# EAGLE design PCB (EAGLE 9.6.2)
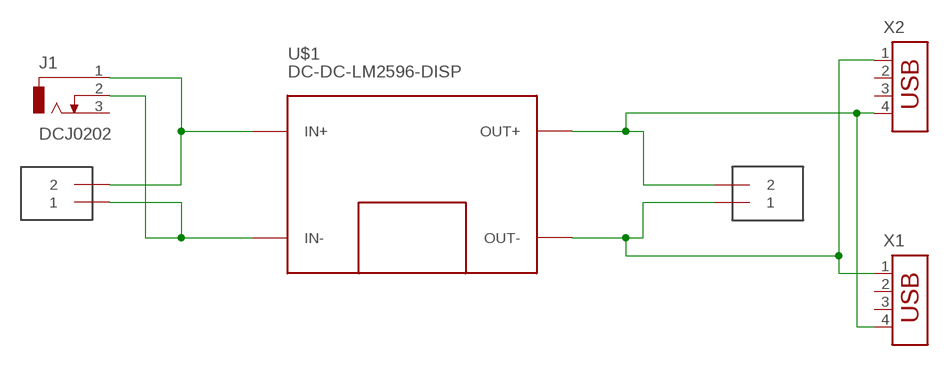
[diagram p0: schematic, sheet 1]

## Parts
J1  DCJ0202  [DCJ0202]
U$1  DC-DC-LM2596-DISP  [DC-DC-LM2596-DISP]
U$2  TERMINAL_2P  [KF301-2P]
U$3  TERMINAL_2P  [KF301-2P]
X1  USB-787616  [USB]
X2  USB-787616  [USB]

## Nets
N$1: J1.1 U$1.IN+ U$2.2
N$2: J1.2 U$1.IN- U$2.1
N$4: U$1.OUT+ U$3.2 X1.4 X2.4
N$6: U$1.OUT- U$3.1 X1.1 X2.1
Unconnected: J1.3 X1.2 X1.3 X2.2 X2.3

## Library data of the parts
J1 = con-jack:DCJ0202: DC POWER JACK Source: DCJ0202.pdf; OC_FARNELL: unknown; OC_NEWARK: unknown
U$1 = lm2596:DC-DC-LM2596-DISP: DC/DC Step-Down Regulator with Voltage Display based on LM2596-ADJ chip More details available here: http://www.instructables.com/id/The-Introduction-of-LM2596-Step-Down-Power-Module-/ LM2596 datasheet available here: http://www.ti.com/lit/ds/symlink/lm2596.pdf Click here to find device on ebay.com <http://www.ebay.com/sch/lm2596+led+voltmeter+40>
U$2 U$3 = KF301-2P-Terminal:TERMINAL_2P: Terminal Screw 2 Port 5mm Pitch
X1 X2 = con-amp:USB-787616: AMP connector

## Board
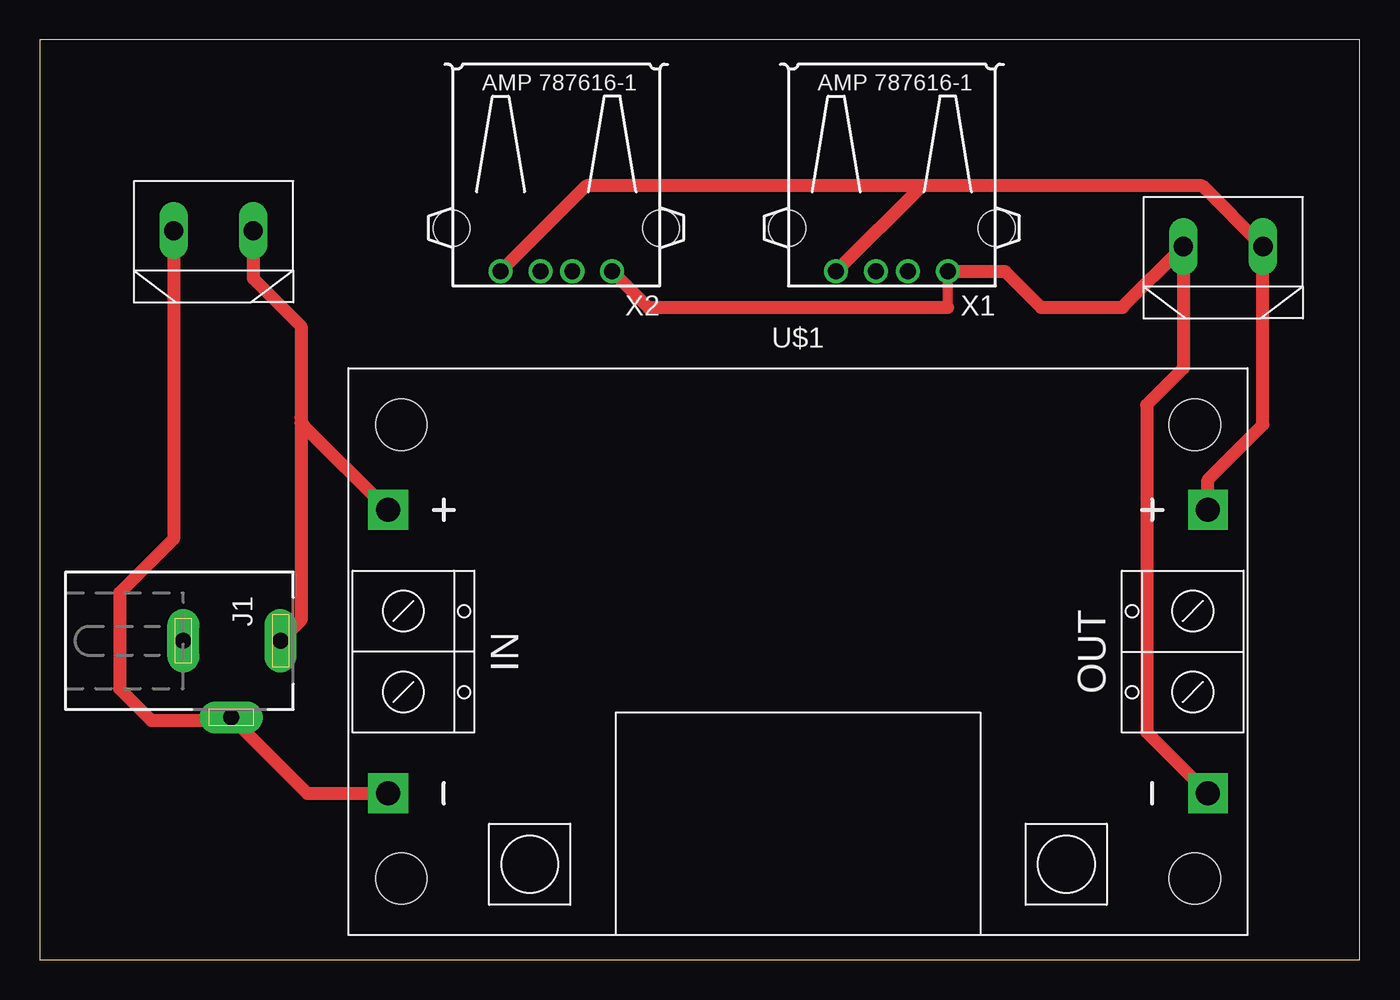
[diagram p1: board, top side]

Size 82.79 x 57.68 mm. Coordinates in mm from the lower left corner, seen from the top.
Outline: 0,0 82.79,0 82.79,57.68 0,57.68 0,0
Copper layers (1*16): Top 0.035mm / dielectric 1.5mm / Bottom 0.035mm
Design rules "default": minimum track width 6mil, minimum drill 0.35mm, track to track 6mil, track to pad 6mil, pad to pad 6mil, via to via 6mil, smd to smd 6mil, copper to edge 40mil, drill to drill 6mil, minimum pad ring 10mil, minimum via ring 8mil, stop-mask expansion 4mil, vias tented up to drill 0mil, thermal gap 10mil

### Footprints (pad centres in the part's own frame; a part is rotated, then mirrored left to right if it is on the bottom)
DCJ0202 = drill 1 pad 2 long: 1 0,3.1; 2 4.8,0; 3 0,-3
DC-DC-LM2596-DISP = drill 1.5 pad 2.5 square: IN+ -25.718,8.89; IN- -25.718,-8.89; OUT+ 25.718,8.89; OUT- 25.718,-8.89 | hole 3.2: -24.892,14.224; 24.892,-14.224; 24.892,14.224; -24.892,-14.224
KF301-2P = drill 1.2 pad 1.778 long: 1 -2.5,0; 2 2.5,0
USB = drill 1: 1 -3.5,12.99; 2 -1,12.99; 3 1,12.99; 4 3.5,12.99 | hole 2.3: -6.57,10.28; 6.57,10.28

### Placement (x,y rotation side)
J1  12,20 270 top
U$1  47.56,19.32 0 top
U$2  10.89,45.72 0 top
U$3  74.23,44.72 0 top
X1  53.45,56.15 180 top
X2  32.4,56.15 180 top

### Tracks (layer width: path | path; a pad name or v marks a point on that pad's centre or on a via)
N$1
  Top 0.813: U$2.2 13.39,42.72 16.39,39.72 16.39,34 16.39,33.66 | U$1.IN+ 16.53,33.53 16.39,33.66 | 16.39,33.66 16.39,21.29 J1.1
N$2
  Top 0.813: U$2.1 8.39,26.39 5,23 5,17 7,15 11.8,15 J1.2 16.77,10.43 U$1.IN-
N$4
  Top 0.635: 76.73,44 U$3.2
  Top 0.813: U$1.OUT+ 73.28,30.09 76.73,33.55 76.73,44 | U$3.2 72.92,48.53 55.32,48.53 | 55.32,48.53 X1.4 | 55.32,48.53 34.27,48.53 X2.4
N$6
  Top 0.152: 35.96,42.94 X2.1
  Top 0.635: 56.95,40.91 X1.1
  Top 0.813: X2.1 38.15,40.91 56.95,40.91 | X1.1 60.55,43.16 62.8,40.91 67.92,40.91 U$3.1 71.73,37.1 69.43,34.8 69.43,14.28 U$1.OUT-